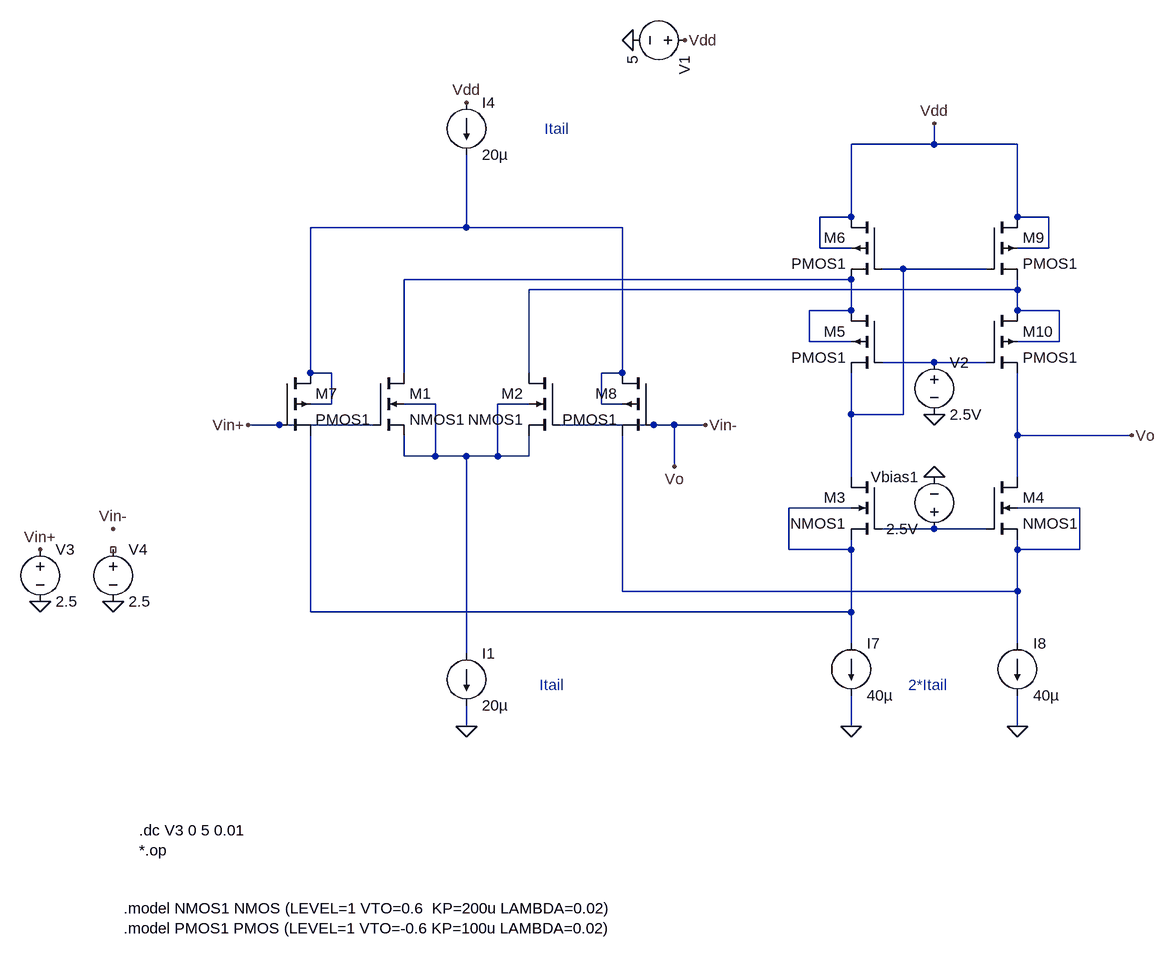
[diagram p0: schematic MOSFET_R2R_Input_Stage.asc]
MOSFET_R2R_Input_Stage.asc, the LTspice schematic file:
Version 4.1
SHEET 1 1320 1588
WIRE 624 224 624 192
WIRE 624 224 496 224
WIRE 752 224 624 224
WIRE 496 336 496 224
WIRE 496 336 448 336
WIRE 752 336 752 224
WIRE 800 336 752 336
WIRE -96 352 -96 240
WIRE -96 352 -336 352
WIRE 144 352 -96 352
WIRE 448 384 448 336
WIRE 496 384 448 384
WIRE 800 384 800 336
WIRE 800 384 752 384
WIRE 576 416 544 416
WIRE 704 416 576 416
WIRE 496 432 -192 432
WIRE 752 448 752 432
WIRE 752 448 0 448
WIRE 496 480 496 432
WIRE 496 480 432 480
WIRE 752 480 752 448
WIRE 816 480 752 480
WIRE 432 528 432 480
WIRE 496 528 432 528
WIRE 816 528 816 480
WIRE 816 528 752 528
WIRE 624 560 544 560
WIRE 704 560 624 560
WIRE -336 576 -336 352
WIRE -304 576 -336 576
WIRE -192 576 -192 432
WIRE 0 576 0 448
WIRE 144 576 144 352
WIRE 144 576 112 576
WIRE -304 624 -304 576
WIRE -304 624 -336 624
WIRE -144 624 -192 624
WIRE 0 624 -48 624
WIRE 112 624 112 576
WIRE 144 624 112 624
WIRE 496 640 496 576
WIRE 576 640 576 416
WIRE 576 640 496 640
WIRE -384 656 -432 656
WIRE -240 656 -384 656
WIRE 192 656 48 656
WIRE 224 656 192 656
WIRE 272 656 224 656
WIRE 752 672 752 576
WIRE 928 672 752 672
WIRE -192 704 -192 672
WIRE -144 704 -144 624
WIRE -144 704 -192 704
WIRE -96 704 -144 704
WIRE -48 704 -48 624
WIRE -48 704 -96 704
WIRE 0 704 0 672
WIRE 0 704 -48 704
WIRE 224 720 224 656
WIRE 496 736 496 640
WIRE 752 736 752 672
WIRE 496 784 400 784
WIRE 848 784 752 784
WIRE 624 816 544 816
WIRE 704 816 624 816
WIRE 400 848 400 784
WIRE 496 848 496 832
WIRE 496 848 400 848
WIRE 752 848 752 832
WIRE 848 848 848 784
WIRE 848 848 752 848
WIRE 144 912 144 672
WIRE 752 912 752 848
WIRE 752 912 144 912
WIRE -336 944 -336 672
WIRE 496 944 496 848
WIRE 496 944 -336 944
WIRE 496 992 496 944
WIRE 752 992 752 912
WIRE -96 1008 -96 704
WIRE -96 1120 -96 1088
WIRE 496 1120 496 1072
WIRE 752 1120 752 1072
FLAG -96 1120 0
FLAG 272 656 Vin-
FLAG -432 656 Vin+
FLAG 160 64 0
FLAG 240 64 Vdd
FLAG -96 160 Vdd
FLAG 496 1120 0
FLAG 752 1120 0
FLAG 624 192 Vdd
FLAG 624 736 0
FLAG 624 640 0
FLAG 928 672 Vo
FLAG -752 928 0
FLAG -640 928 0
FLAG -752 848 Vin+
FLAG -640 816 Vin-
FLAG 224 720 Vo
DATAFLAG 848 672 ""
DATAFLAG 416 944 ""
DATAFLAG 656 912 ""
DATAFLAG 496 688 ""
SYMBOL nmos4 -240 576 R0
SYMATTR InstName M1
SYMATTR Value NMOS1
SYMBOL nmos4 48 576 M0
SYMATTR InstName M2
SYMATTR Value NMOS1
SYMBOL current -96 1008 R0
WINDOW 123 0 0 Left 0
WINDOW 39 0 0 Left 0
SYMATTR InstName I1
SYMATTR Value 20µ
SYMBOL pmos4 -384 576 R0
SYMATTR InstName M7
SYMATTR Value PMOS1
SYMBOL pmos4 192 576 M0
SYMATTR InstName M8
SYMATTR Value PMOS1
SYMBOL current -96 160 R0
WINDOW 123 0 0 Left 0
WINDOW 39 0 0 Left 0
SYMATTR InstName I4
SYMATTR Value 20µ
SYMBOL voltage 256 64 R90
WINDOW 123 0 0 Left 0
WINDOW 39 0 0 Left 0
SYMATTR InstName V1
SYMATTR Value 5
SYMBOL current 496 992 R0
WINDOW 123 0 0 Left 0
WINDOW 39 0 0 Left 0
SYMATTR InstName I7
SYMATTR Value 40µ
SYMBOL current 752 992 R0
WINDOW 123 0 0 Left 0
WINDOW 39 0 0 Left 0
SYMATTR InstName I8
SYMATTR Value 40µ
SYMBOL nmos4 544 736 M0
SYMATTR InstName M3
SYMATTR Value NMOS1
SYMBOL nmos4 704 736 R0
SYMATTR InstName M4
SYMATTR Value NMOS1
SYMBOL voltage 624 832 R180
WINDOW 0 24 96 Left 2
WINDOW 3 24 16 Left 2
WINDOW 123 0 0 Left 0
WINDOW 39 0 0 Left 0
SYMATTR InstName Vbias1
SYMATTR Value 2.5V
SYMBOL pmos4 544 480 M0
SYMATTR InstName M5
SYMATTR Value PMOS1
SYMBOL pmos4 544 336 M0
SYMATTR InstName M6
SYMATTR Value PMOS1
SYMBOL pmos4 704 336 R0
SYMATTR InstName M9
SYMATTR Value PMOS1
SYMBOL pmos4 704 480 R0
SYMATTR InstName M10
SYMATTR Value PMOS1
SYMBOL voltage 624 544 R0
WINDOW 123 0 0 Left 0
WINDOW 39 0 0 Left 0
SYMATTR InstName V2
SYMATTR Value 2.5V
SYMBOL voltage -752 832 R0
WINDOW 123 0 0 Left 0
WINDOW 39 0 0 Left 0
SYMATTR InstName V3
SYMATTR Value 2.5
SYMBOL voltage -640 832 R0
WINDOW 123 0 0 Left 0
WINDOW 39 0 0 Left 0
SYMATTR InstName V4
SYMATTR Value 2.5
TEXT 24 200 Left 2 ;Itail
TEXT 16 1056 Left 2 ;Itail
TEXT 584 1056 Left 2 ;2*Itail
TEXT -624 1400 Left 2 !.model NMOS1 NMOS (LEVEL=1 VTO=0.6  KP=200u LAMBDA=0.02)\n.model PMOS1 PMOS (LEVEL=1 VTO=-0.6 KP=100u LAMBDA=0.02)
TEXT -600 1280 Left 2 !.dc V3 0 5 0.01\n*.op

The netlist it stands for:
* MOSFET_R2R_Input_Stage.asc
M1 N003 Vin+ N006 N006 NMOS1
M2 N004 Vo N006 N006 NMOS1
I1 N006 0 20µ
M7 N001 Vin+ N007 N001 PMOS1
M8 N001 Vo N008 N001 PMOS1
I4 Vdd N001 20µ
V1 Vdd 0 5
I7 N007 0 40µ
I8 N008 0 40µ
M3 N002 N009 N007 N007 NMOS1
M4 Vo N009 N008 N008 NMOS1
Vbias1 N009 0 2.5V
M5 N003 N005 N002 N003 PMOS1
M6 Vdd N002 N003 Vdd PMOS1
M9 Vdd N002 N004 Vdd PMOS1
M10 N004 N005 Vo N004 PMOS1
V2 N005 0 2.5V
V3 Vin+ 0 2.5
V4 NC_01 0 2.5
.model NMOS NMOS
.model PMOS PMOS
.lib standard.mos
* Itail
* Itail
* 2*Itail
.model NMOS1 NMOS (LEVEL=1 VTO=0.6  KP=200u LAMBDA=0.02)
.model PMOS1 PMOS (LEVEL=1 VTO=-0.6 KP=100u LAMBDA=0.02)
.dc V3 0 5 0.01
*.op
.backanno
.end

* Results of the author's LTspice run, read from the files saved beside the schematic
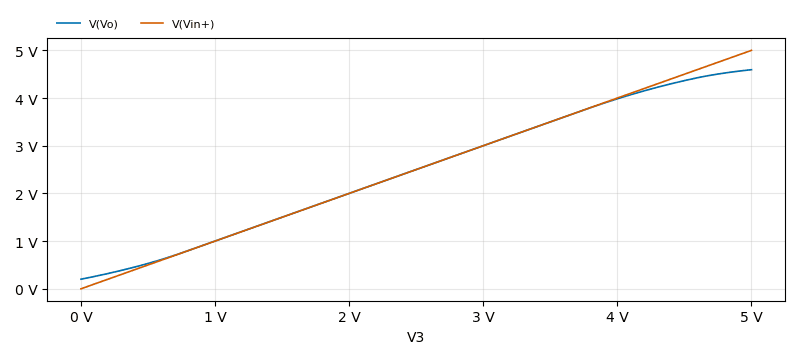
[diagram p1: DC transfer characteristic of MOSFET_R2R_Input_Stage.asc, plotted from the saved traces]
* DC transfer characteristic, 1 run:
*   V(Vo): 201.8 mV at V3=0 V, 4.595 V at V3=5 V, min 201.8 mV, max 4.595 V
*   V(Vin+): 0 V at V3=0 V, 5 V at V3=5 V, min 0 V, max 5 V